# Altium schematic sheet B38_TopSheet.SchDoc
size A2; SheetNumber: 1; SheetTotal: 11
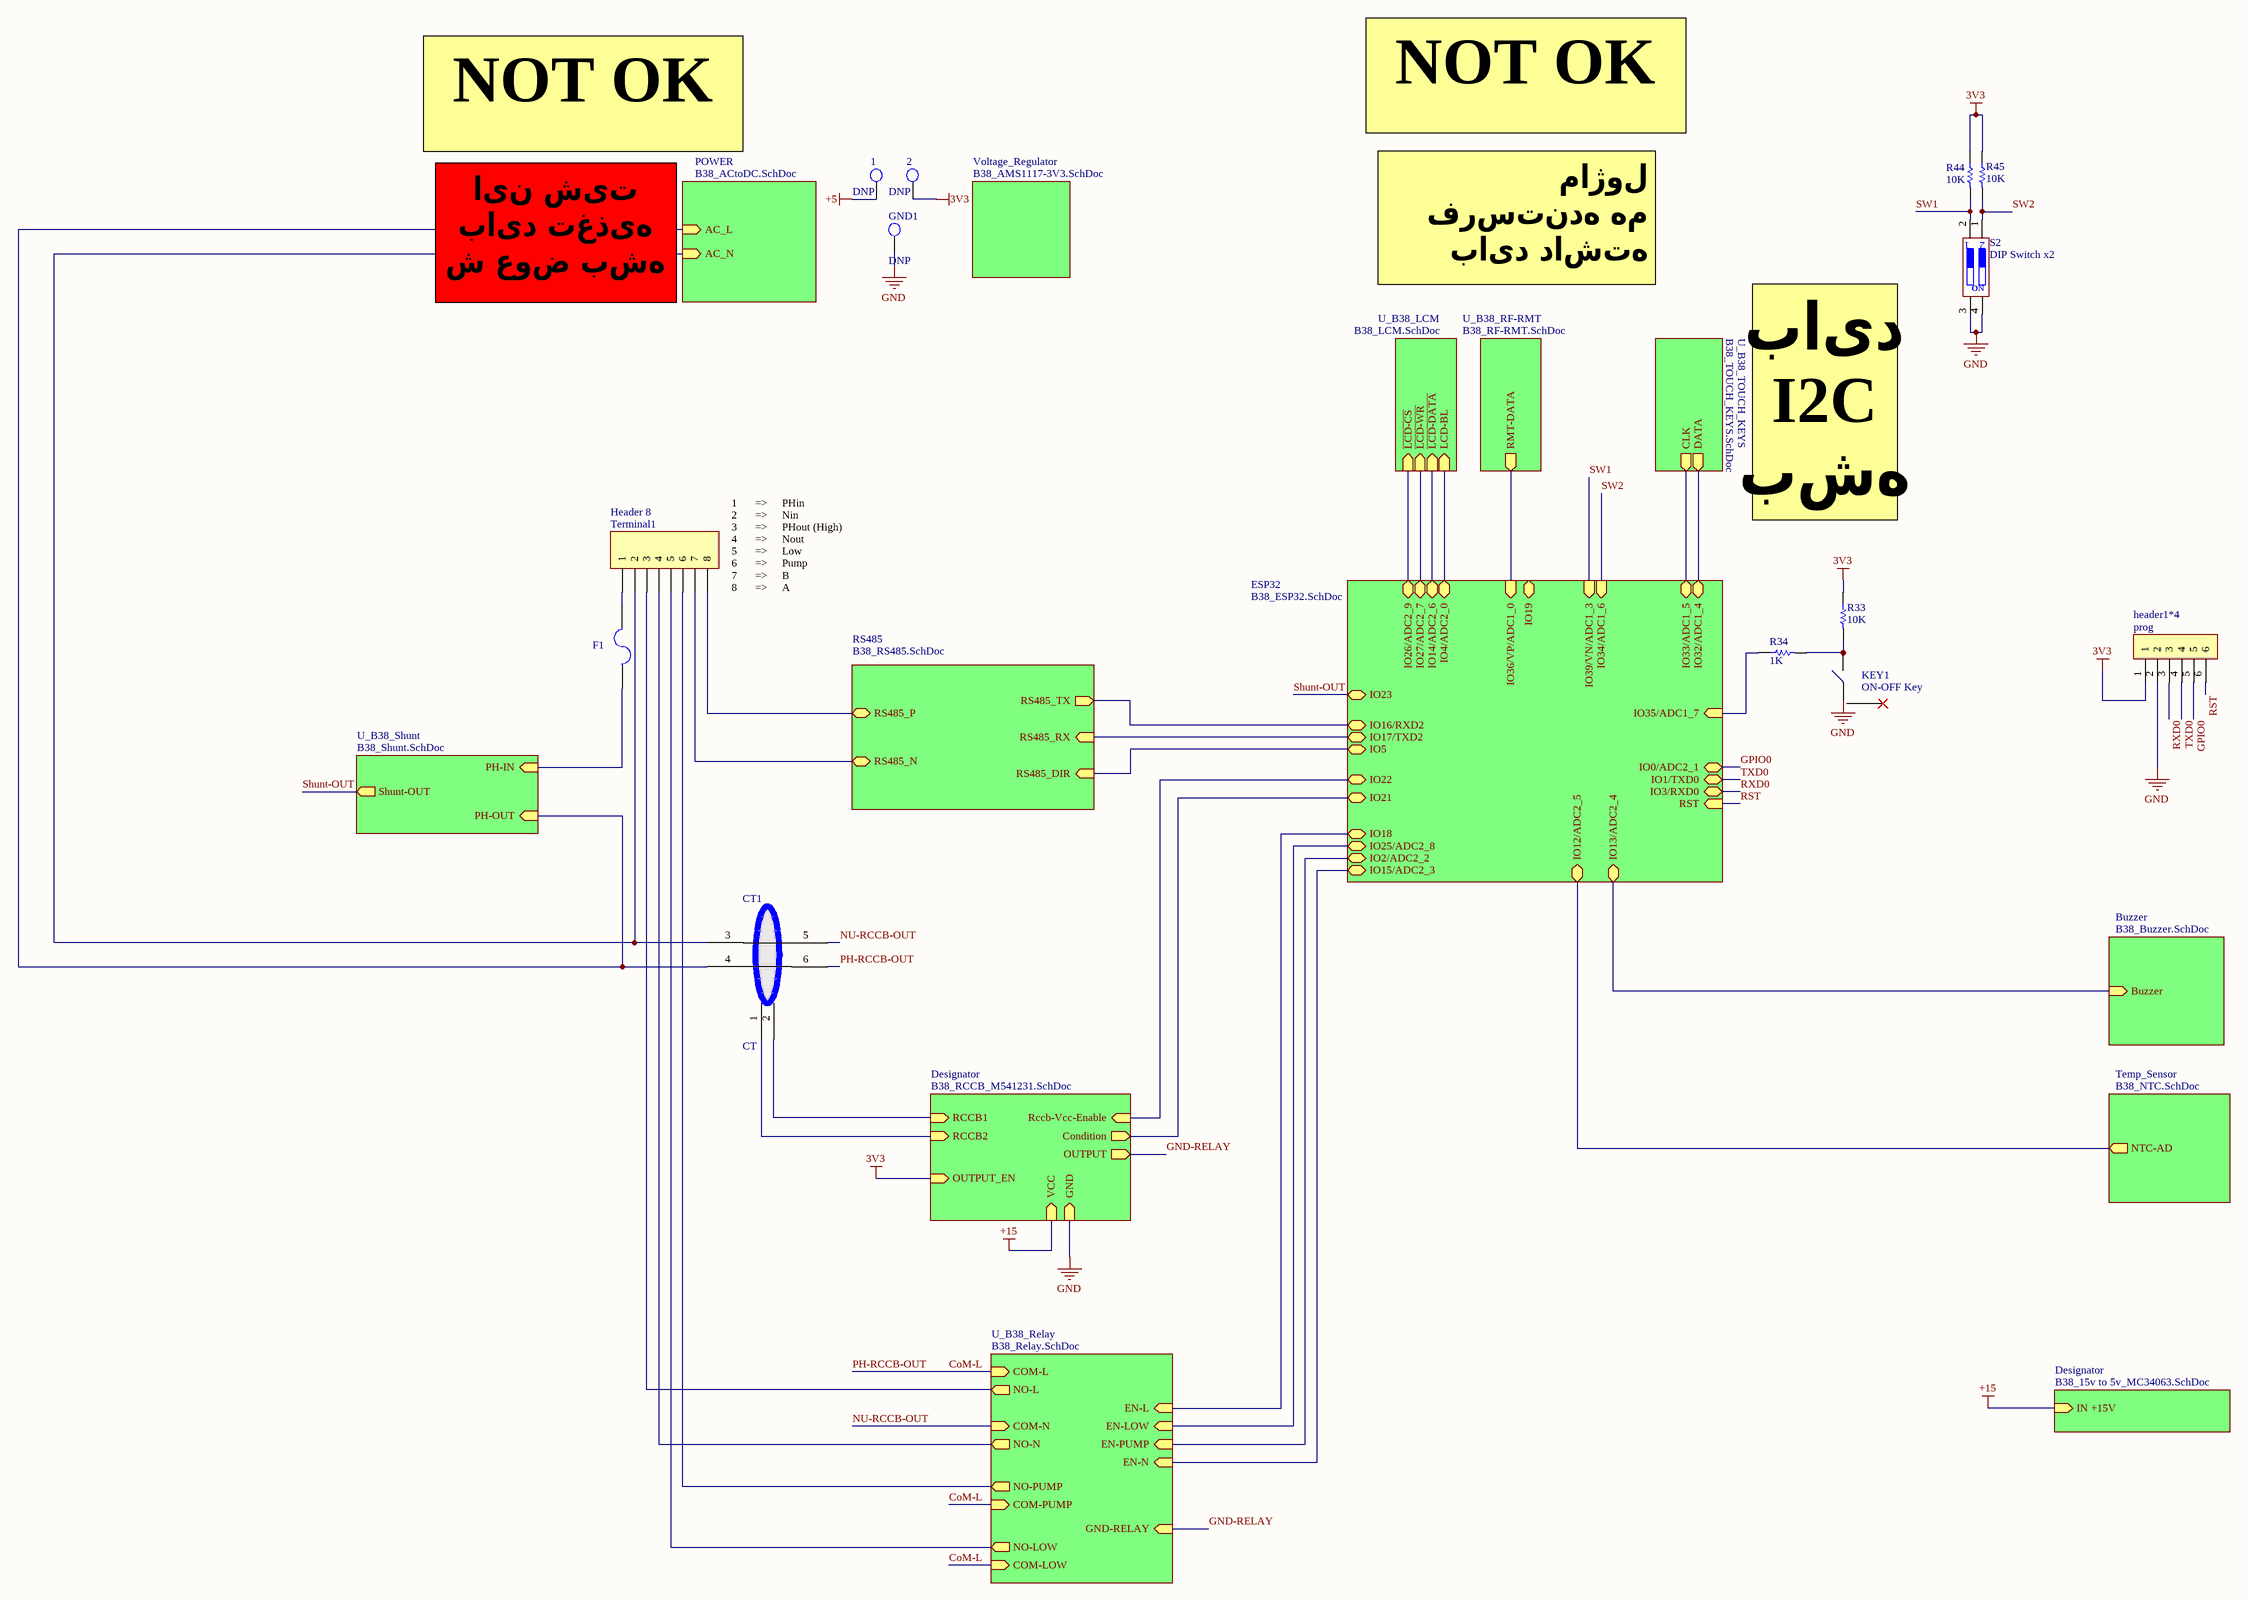
[diagram p0: B38_TopSheet.SchDoc]

## Parts
1  DNP  [TP]
2  DNP  [TP]
CT1  CT  [RCCB-CT]
F1  F=1.0 A  [FUSE 5X20]  (value not drawn)
GND1  DNP  [TP]
KEY1  ON-OFF Key  [push button]
prog  header1*4  [header-2.54mm]
R33  10K  [RES0603]
R34  1K  [RES0603]
R44  10K  [RES0603]
R45  10K  [RES0603]
S2  DIP Switch x2  [GDS02s-2.54 smd]
Terminal1  Header 8  [Terminal]

## Sub-sheets
Buzzer = B38_Buzzer.SchDoc: Buzzer (in)
Designator = B38_15v to 5v_MC34063.SchDoc: IN +15V (in)
Designator = B38_RCCB_M541231.SchDoc: VCC (in), OUTPUT (out), OUTPUT_EN (in), Condition (out), RCCB1 (in), RCCB2 (in), Rccb-Vcc-Enable (in), GND (in)
ESP32 = B38_ESP32.SchDoc: IO3/RXD0 (bidir), IO1/TXD0 (bidir), IO22 (bidir), IO23 (bidir), IO21 (bidir), IO19 (bidir), IO18 (bidir), IO5 (bidir), IO4/ADC2_0 (bidir), IO15/ADC2_3 (bidir), IO0/ADC2_1 (bidir), IO33/ADC1_5 (bidir), IO2/ADC2_2 (bidir), IO27/ADC2_7 (bidir), IO36/VP/ADC1_0 (in), IO39/VN/ADC1_3 (in), IO14/ADC2_6 (bidir), IO25/ADC2_8 (bidir), IO32/ADC1_4 (bidir), IO16/RXD2 (bidir), IO17/TXD2 (bidir), RST (in), IO13/ADC2_4 (bidir), IO12/ADC2_5 (bidir), IO26/ADC2_9 (bidir), IO34/ADC1_6 (in), IO35/ADC1_7 (in)
POWER = B38_ACtoDC.SchDoc: AC_N (in), AC_L (in)
RS485 = B38_RS485.SchDoc: RS485_DIR (in), RS485_P (bidir), RS485_TX (out), RS485_RX (in), RS485_N (bidir)
Temp_Sensor = B38_NTC.SchDoc: NTC-AD (out)
U_B38_LCM = B38_LCM.SchDoc: ~{LCD-CS} (in), ~{LCD-WR} (in), ~{LCD-DATA} (in), LCD-BL (in)
U_B38_Relay = B38_Relay.SchDoc: NO-L (out), COM-L (in), EN-L (in), NO-N (out), COM-N (in), EN-N (in), COM-PUMP (in), COM-LOW (in), NO-PUMP (out), NO-LOW (out), EN-LOW (in), EN-PUMP (in), GND-RELAY (in)
U_B38_RF-RMT = B38_RF-RMT.SchDoc: RMT-DATA (out)
U_B38_Shunt = B38_Shunt.SchDoc: PH-IN (in), Shunt-OUT (out), PH-OUT (in)
U_B38_TOUCH_KEYS = B38_TOUCH_KEYS.SchDoc: DATA (out), CLK (out)
Voltage_Regulator = B38_AMS1117-3V3.SchDoc: no entries

## Nets
3V3: 2.1 prog.1 R33.1 R44.1 R45.1 ; sheet Designator/OUTPUT_EN
+5: 1.1
+15: sheet Designator/IN +15V, sheet Designator/VCC
GND: GND1.1 KEY1.1 prog.2 S2.3 S2.4 ; sheet Designator/GND
CoM-L: CT1.6 ; sheet U_B38_Relay/COM-L, sheet U_B38_Relay/COM-PUMP, sheet U_B38_Relay/COM-LOW  [also labelled PH-RCCB-OUT]
GND-RELAY: sheet U_B38_Relay/GND-RELAY, sheet Designator/OUTPUT
GPIO0: prog.5 ; sheet ESP32/IO0/ADC2_1
NU-RCCB-OUT: CT1.5 ; sheet U_B38_Relay/COM-N
RST: prog.6 ; sheet ESP32/RST
RXD0: prog.3 ; sheet ESP32/IO3/RXD0
Shunt-OUT: sheet ESP32/IO23, sheet U_B38_Shunt/Shunt-OUT
SW1: R44.2 S2.2 ; sheet ESP32/IO39/VN/ADC1_3
SW2: R45.2 S2.1 ; sheet ESP32/IO34/ADC1_6
TXD0: prog.4 ; sheet ESP32/IO1/TXD0
NetCT1_1: CT1.1 ; sheet Designator/RCCB2
NetCT1_2: CT1.2 ; sheet Designator/RCCB1
NetCT1_3: CT1.3 Terminal1.2 ; sheet POWER/AC_N
NetCT1_4: CT1.4 ; sheet POWER/AC_L, sheet U_B38_Shunt/PH-OUT
NetF1_1: F1.1 ; sheet U_B38_Shunt/PH-IN
NetF1_2: F1.2 Terminal1.1
NetKEY1_2: KEY1.2 R33.2 R34.2
NetR34_1: R34.1 ; sheet ESP32/IO35/ADC1_7
NetTerminal1_3: Terminal1.3 ; sheet U_B38_Relay/NO-L
NetTerminal1_4: Terminal1.4 ; sheet U_B38_Relay/NO-N
NetTerminal1_5: Terminal1.5 ; sheet U_B38_Relay/NO-LOW
NetTerminal1_6: Terminal1.6 ; sheet U_B38_Relay/NO-PUMP
NetTerminal1_7: Terminal1.7 ; sheet RS485/RS485_N
NetTerminal1_8: Terminal1.8 ; sheet RS485/RS485_P
(unnamed): sheet Temp_Sensor/NTC-AD, sheet ESP32/IO12/ADC2_5
(unnamed): sheet Buzzer/Buzzer, sheet ESP32/IO13/ADC2_4
(unnamed): sheet RS485/RS485_DIR, sheet ESP32/IO5
(unnamed): sheet RS485/RS485_TX, sheet ESP32/IO16/RXD2
(unnamed): sheet RS485/RS485_RX, sheet ESP32/IO17/TXD2
(unnamed): sheet ESP32/IO22, sheet Designator/Rccb-Vcc-Enable
(unnamed): sheet ESP32/IO21, sheet Designator/Condition
(unnamed): sheet ESP32/IO18, sheet U_B38_Relay/EN-L
(unnamed): sheet ESP32/IO4/ADC2_0, sheet U_B38_LCM/LCD-BL
(unnamed): sheet ESP32/IO15/ADC2_3, sheet U_B38_Relay/EN-N
(unnamed): sheet ESP32/IO33/ADC1_5, sheet U_B38_TOUCH_KEYS/CLK
(unnamed): sheet ESP32/IO2/ADC2_2, sheet U_B38_Relay/EN-PUMP
(unnamed): sheet ESP32/IO27/ADC2_7, sheet U_B38_LCM/~{LCD-WR}
(unnamed): sheet ESP32/IO36/VP/ADC1_0, sheet U_B38_RF-RMT/RMT-DATA
(unnamed): sheet ESP32/IO14/ADC2_6, sheet U_B38_LCM/~{LCD-DATA}
(unnamed): sheet ESP32/IO25/ADC2_8, sheet U_B38_Relay/EN-LOW
(unnamed): sheet ESP32/IO32/ADC1_4, sheet U_B38_TOUCH_KEYS/DATA
(unnamed): sheet ESP32/IO26/ADC2_9, sheet U_B38_LCM/~{LCD-CS}

Not connected (* = marked no-connect by the designer): KEY1 0(B)*

## Notes on the sheet
- NOT OK
- ماژول فرستنده هم باید داشته باشم
- این شیت باید تغذیه ش عوض بشه به 220 به 15 ولت
- باید I2C بشه
- (near Terminal1) 1      =>     PHin
  2      =>     Nin
  3      =>     PHout (High)
  4      =>     Nout
  5      =>     Low
  6      =>     Pump
  7      =>     B
  8      =>     A
- Title
- Size:
- Date:
- File:
- A2
- Number:
- Time:
- Revision:
- Sheet
- of
- (in symbol DIP Switch x2) ON

## Library data of the parts
1 2 GND1 = TP
F1 = Fuse 5x20 with holdeer pins: Fuses 5x20; Designer: Abbas Basereh; Desc.: fuse with holder pins 5x20; Data: 28-12-2016
KEY1 = SW
R33 R34 R44 R45 = Res1: Resistor 5%; Manufacturer: Panasonic; PN: ERJ3GEYJ101V; Value: 100Ω
Terminal1 = Header 8: Header, 8-Pin